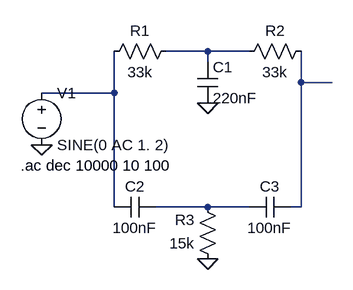
[diagram p0: schematic notch filter.asc]
notch filter.asc, the LTspice schematic file:
Version 4
SHEET 1 1124 680
WIRE 32 -624 -32 -624
WIRE 96 -624 32 -624
WIRE 32 -608 32 -624
WIRE 176 -576 176 -624
WIRE 224 -576 176 -576
WIRE -112 -560 -112 -624
WIRE -112 -560 -224 -560
WIRE -112 -384 -112 -560
WIRE 32 -384 -48 -384
WIRE 96 -384 32 -384
WIRE 176 -384 176 -576
WIRE 176 -384 160 -384
FLAG -224 -480 0
FLAG 32 -304 0
FLAG 32 -544 0
SYMBOL voltage -224 -576 R0
WINDOW 123 0 0 Left 0
WINDOW 39 0 0 Left 0
SYMATTR InstName V1
SYMATTR Value SINE(0 AC 1. 2)
SYMBOL res -16 -640 R90
WINDOW 0 0 56 VBottom 2
WINDOW 3 32 56 VTop 2
SYMATTR InstName R1
SYMATTR Value 33k
SYMBOL res 192 -640 R90
WINDOW 0 0 56 VBottom 2
WINDOW 3 32 56 VTop 2
SYMATTR InstName R2
SYMATTR Value 33k
SYMBOL res 48 -288 R180
WINDOW 0 36 76 Left 2
WINDOW 3 36 40 Left 2
SYMATTR InstName R3
SYMATTR Value 15k
SYMBOL cap 16 -608 R0
SYMATTR InstName C1
SYMATTR Value 220nF
SYMBOL cap -48 -400 R90
WINDOW 0 0 32 VBottom 2
WINDOW 3 32 32 VTop 2
SYMATTR InstName C2
SYMATTR Value 100nF
SYMBOL cap 160 -400 R90
WINDOW 0 0 32 VBottom 2
WINDOW 3 32 32 VTop 2
SYMATTR InstName C3
SYMATTR Value 100nF
TEXT -256 -448 Left 2 !.ac dec 10000 10 100

The netlist it stands for:
* notch filter.asc
V1 N003 0 SINE(0 AC 1. 2)
R1 N001 N003 33k
R2 N002 N001 33k
R3 0 N004 15k
C1 N001 0 220nF
C2 N004 N003 100nF
C3 N002 N004 100nF
.ac dec 10000 10 100
.backanno
.end